# Altium schematic sheet Motor_Board.SchDoc: Top Level - Motor Board
size A4; DrawnBy: wgl18, hvj10; Organization: ENEL429 Group 9; Address1: ECE Department; Address2: University of Canterbury; Address3: Christchurch 8041; Address4: New Zealand; Revision: 1; SheetNumber: 1; SheetTotal: 5
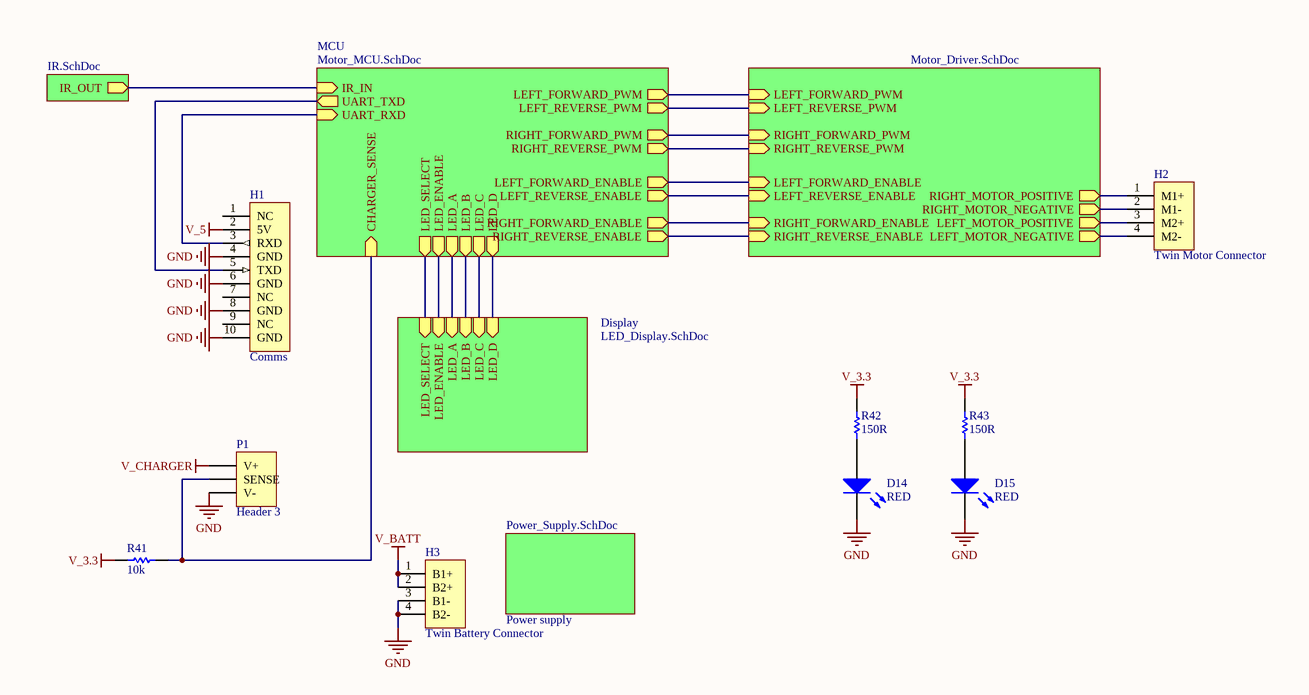
[diagram p0: Motor_Board.SchDoc]

## Parts
D14  value RED  [Diode_0805]  (hidden comment: LED Red)
D15  value RED  [Diode_0805]  (hidden comment: LED Red)
H1  Comms  [918510x323]
H2  Twin Motor Connector  [TMHDR4]
H3  Twin Battery Connector  [TMHDR4]
P1  Header 3  [DC power jack]
R41  10k  [0603]
R42  150R  [0603]
R43  150R  [0603]

## Sub-sheets
Display = LED_Display.SchDoc: LED_ENABLE (in), LED_A (in), LED_B (in), LED_C (in), LED_D (in), LED_SELECT (in)
MCU = Motor_MCU.SchDoc: LEFT_FORWARD_PWM (out), LEFT_REVERSE_PWM (out), RIGHT_REVERSE_PWM (out), RIGHT_FORWARD_PWM (out), UART_RXD (in), UART_TXD (out), IR_IN (in), LED_SELECT (out), LED_ENABLE (out), LED_A (out), LED_B (out), LED_C (out), LED_D (out), LEFT_FORWARD_ENABLE (out), LEFT_REVERSE_ENABLE (out), RIGHT_REVERSE_ENABLE (out), RIGHT_FORWARD_ENABLE (out), CHARGER_SENSE (in)
Power supply = Power_Supply.SchDoc: no entries
? = Motor_Driver.SchDoc: LEFT_FORWARD_PWM (in), RIGHT_REVERSE_PWM (in), LEFT_MOTOR_POSITIVE (out), RIGHT_MOTOR_POSITIVE (out), LEFT_REVERSE_PWM (in), RIGHT_FORWARD_PWM (in), RIGHT_MOTOR_NEGATIVE (out), LEFT_MOTOR_NEGATIVE (out), RIGHT_REVERSE_ENABLE (in), RIGHT_FORWARD_ENABLE (in), LEFT_FORWARD_ENABLE (in), LEFT_REVERSE_ENABLE (in)
? = IR.SchDoc: IR_OUT (out)

## Nets
GND: D14.2(K) D15.2(K) H1.4(GND) H1.6(GND) H1.8(GND) H1.10(GND) H3.3(B1-) H3.4(B2-) P1.3(V-)
V_3.3: R41.1 R42.2 R43.2
V_5: H1.2(5V)
V_BATT: H3.1(B1+) H3.2(B2+)
V_CHARGER: P1.1(V+)
NetD14_1: D14.1(A) R42.1
NetD15_1: D15.1(A) R43.1
NetH1_3: H1.3(RXD) ; sheet MCU/UART_RXD
NetH1_5: H1.5(TXD) ; sheet MCU/UART_TXD
NetH2_1: H2.1(M1+) ; sheet /RIGHT_MOTOR_POSITIVE
NetH2_2: H2.2(M1-) ; sheet /RIGHT_MOTOR_NEGATIVE
NetH2_3: H2.3(M2+) ; sheet /LEFT_MOTOR_POSITIVE
NetH2_4: H2.4(M2-) ; sheet /LEFT_MOTOR_NEGATIVE
NetP1_2: P1.2(SENSE) R41.2 ; sheet MCU/CHARGER_SENSE
(unnamed): sheet /LEFT_FORWARD_PWM, sheet MCU/LEFT_FORWARD_PWM
(unnamed): sheet /RIGHT_REVERSE_PWM, sheet MCU/RIGHT_REVERSE_PWM
(unnamed): sheet /LEFT_REVERSE_PWM, sheet MCU/LEFT_REVERSE_PWM
(unnamed): sheet /RIGHT_FORWARD_PWM, sheet MCU/RIGHT_FORWARD_PWM
(unnamed): sheet /RIGHT_REVERSE_ENABLE, sheet MCU/RIGHT_REVERSE_ENABLE
(unnamed): sheet /RIGHT_FORWARD_ENABLE, sheet MCU/RIGHT_FORWARD_ENABLE
(unnamed): sheet /LEFT_FORWARD_ENABLE, sheet MCU/LEFT_FORWARD_ENABLE
(unnamed): sheet /LEFT_REVERSE_ENABLE, sheet MCU/LEFT_REVERSE_ENABLE
(unnamed): sheet /IR_OUT, sheet MCU/IR_IN
(unnamed): sheet MCU/LED_SELECT, sheet Display/LED_SELECT
(unnamed): sheet MCU/LED_ENABLE, sheet Display/LED_ENABLE
(unnamed): sheet MCU/LED_A, sheet Display/LED_A
(unnamed): sheet MCU/LED_B, sheet Display/LED_B
(unnamed): sheet MCU/LED_C, sheet Display/LED_C
(unnamed): sheet MCU/LED_D, sheet Display/LED_D

Not connected (* = marked no-connect by the designer): H1 1(NC) 7(NC) 9(NC)

## Notes on the sheet
- Title
- Drawn by:
- Date:
- Time:
- Revision:
- Sheet
- of
- File:

## Library data of the parts
D14 D15 = DL_LED Red 0805: Red LED 0805; Manufacturer PN: TLMS2100-GS08; Manufacturer: Vishay; Supplier 1: Digi-Key; Supplier Part Number 1: 350-2038-1-ND; Part Number: DL_LED Red 0805; Component Kind: Standard; Component Type: Standard; Designator: DL_LED Red 0805; Pin Count: 2; Simulation: LED0
H1 = Header 10: Header, IDC 10-Pin; LatestRevisionDate: 17-Jul-2002; LatestRevisionNote: Re-released for DXP Platform.; Publisher: Altium Limited
H2 H3 = AVR ISP Header 4: 5.08mm Pluggable Terminal Header; LatestRevisionDate: 17-Jul-2002; LatestRevisionNote: Re-released for DXP Platform.; Publisher: Altium Limited
P1 = Header 3: Header, 3-Pin; pin to pad: 1>3 3>1; LatestRevisionDate: 17-Jul-2002; LatestRevisionNote: Re-released for DXP Platform.; Publisher: Altium Limited
R41 = RS_10k 0603: RES 10.0K OHM 1/10W 1% 0603 SMD; Manufacturer: Yageo; Manufacturer PN: RC0603FR-0710KL; LatestRevisionDate: 29 May 08; Supplier 1: Digi-Key; Supplier Part Number 1: 311-10.0KHRTR-ND; Value: 10k; Part Number: RS_10k 0603; Component Kind: Standard; Component Type: Standard; Designator: RS_10k 0603; Pin Count: 2; Signal Integrity: Res; Simulation: RESISTOR
R42 R43 = RS_150R 0603: RES 150 OHM 1/10W 1% 0603 SMD; Manufacturer: ROHM; Manufacturer PN: MCR03EZPFX1500; LatestRevisionDate: 4th July 08; Supplier 1: Digi-Key; Supplier Part Number 1: RHM150HTR-ND; Value: 150R; Part Number: RS_150R 0603; Component Kind: Standard; Component Type: Standard; Designator: RS_150R 0603; Pin Count: 2; Signal Integrity: Res; Simulation: RESISTOR